# EAGLE design ram (EAGLE 9.6.2)
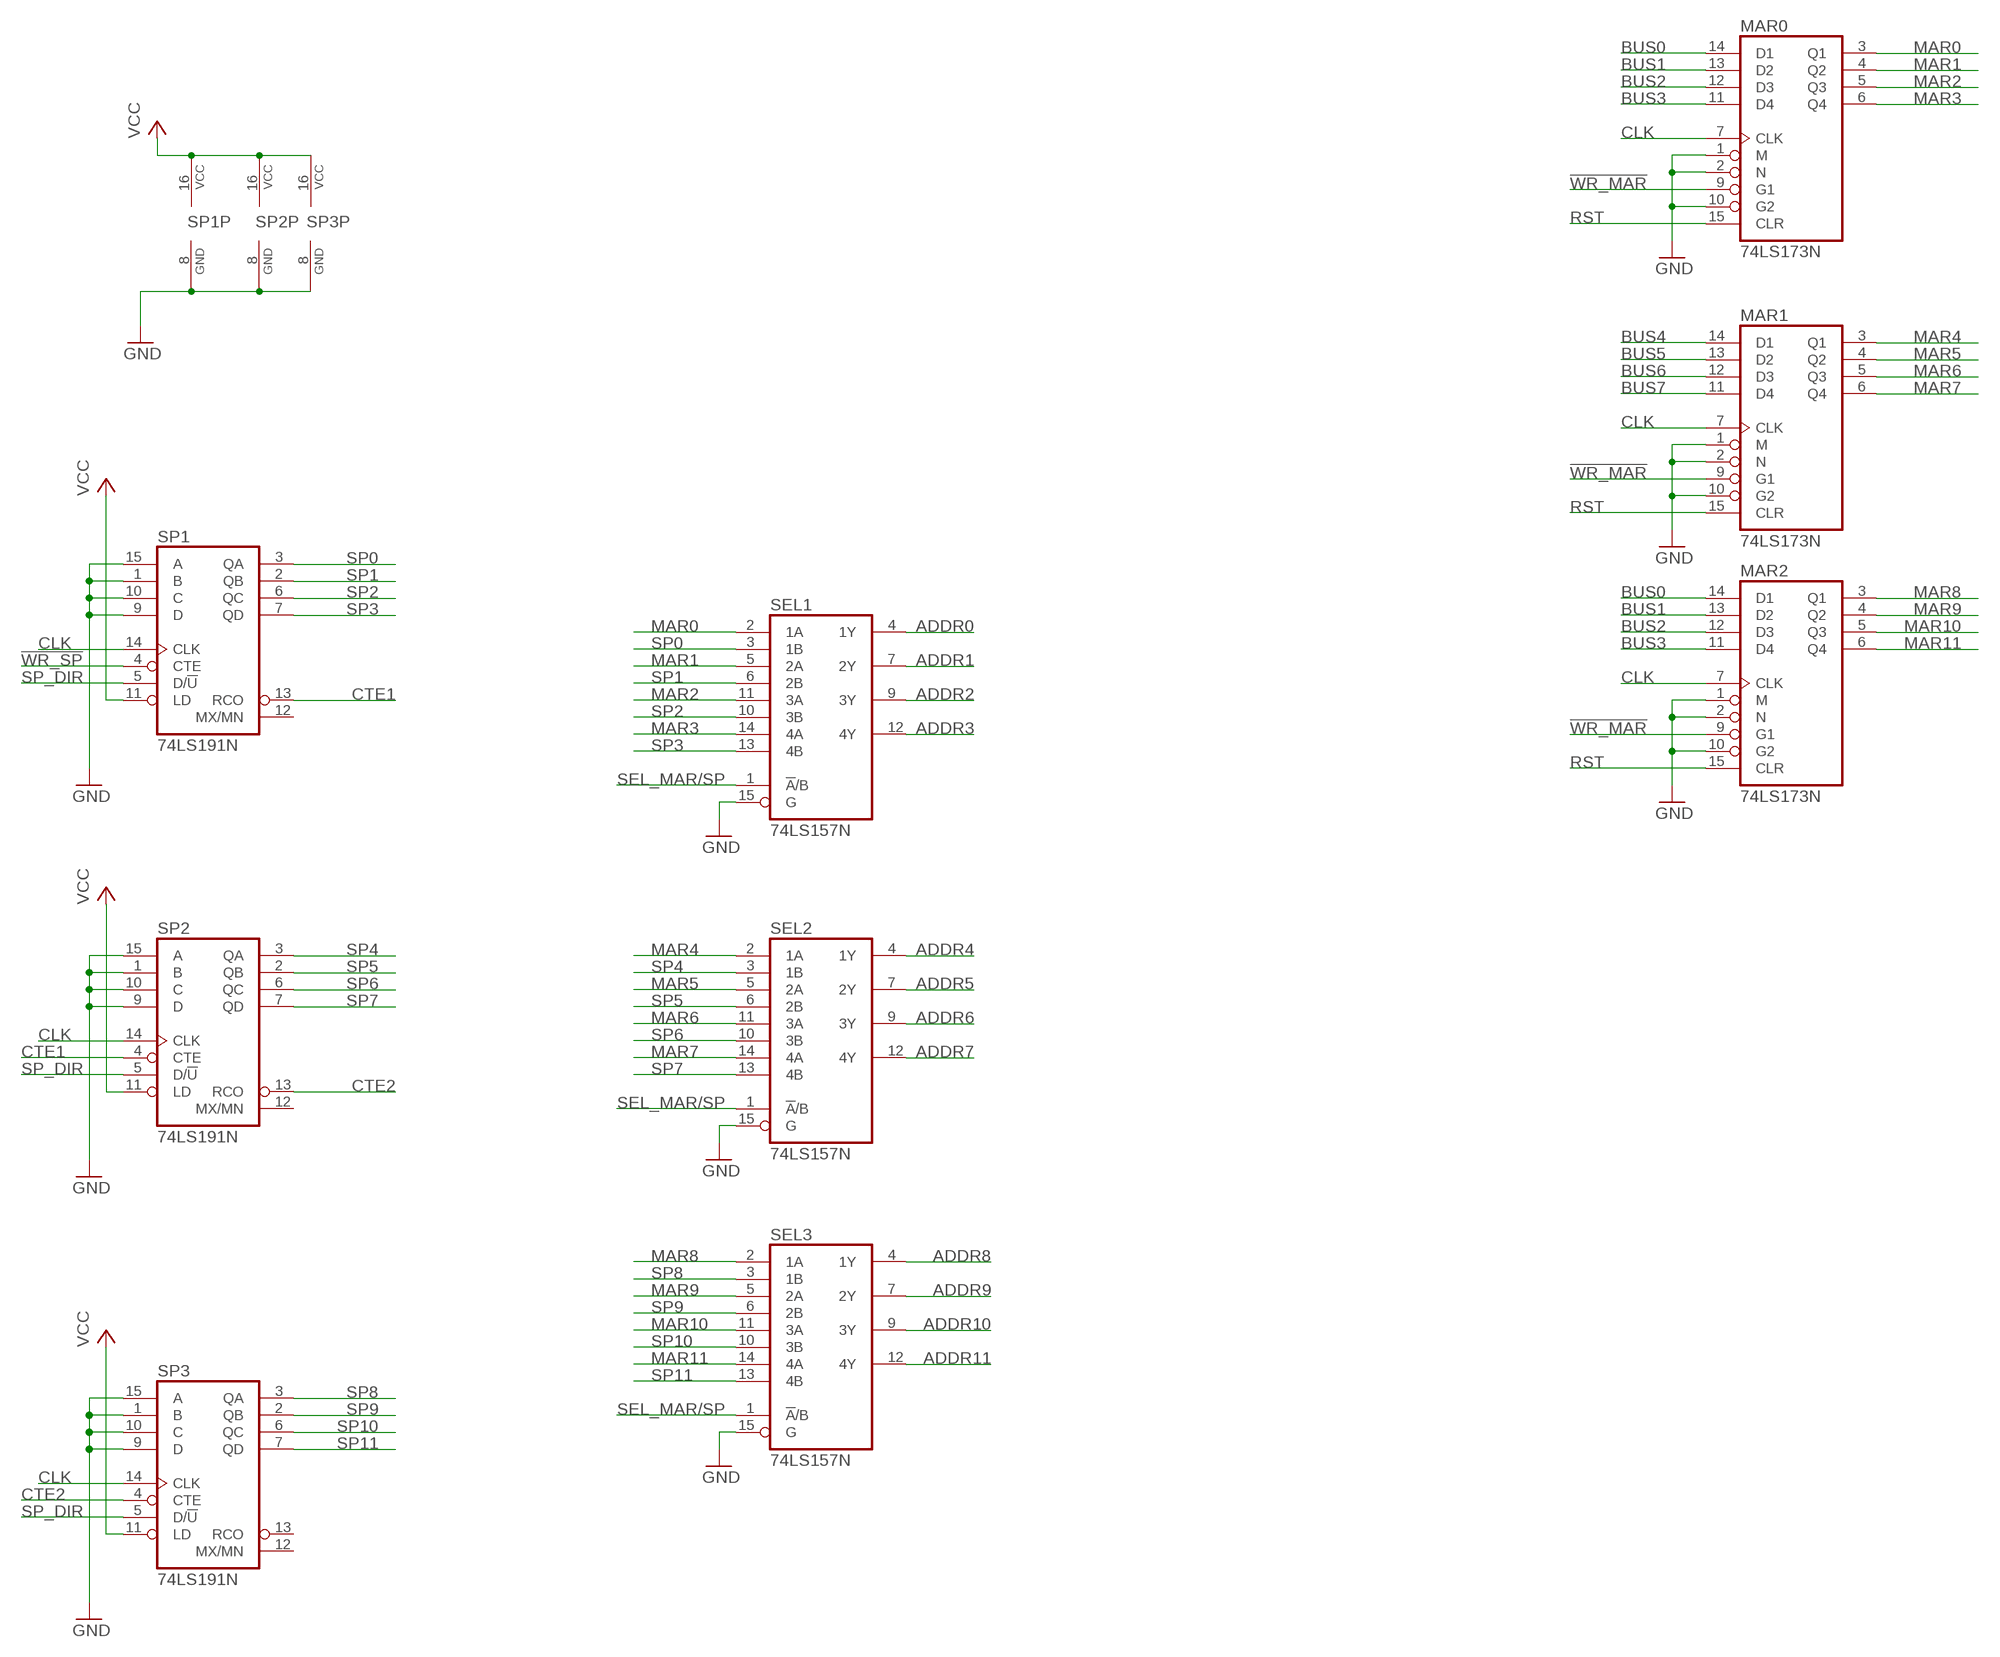
[diagram p0: schematic, sheet 1, part 1 of 2]
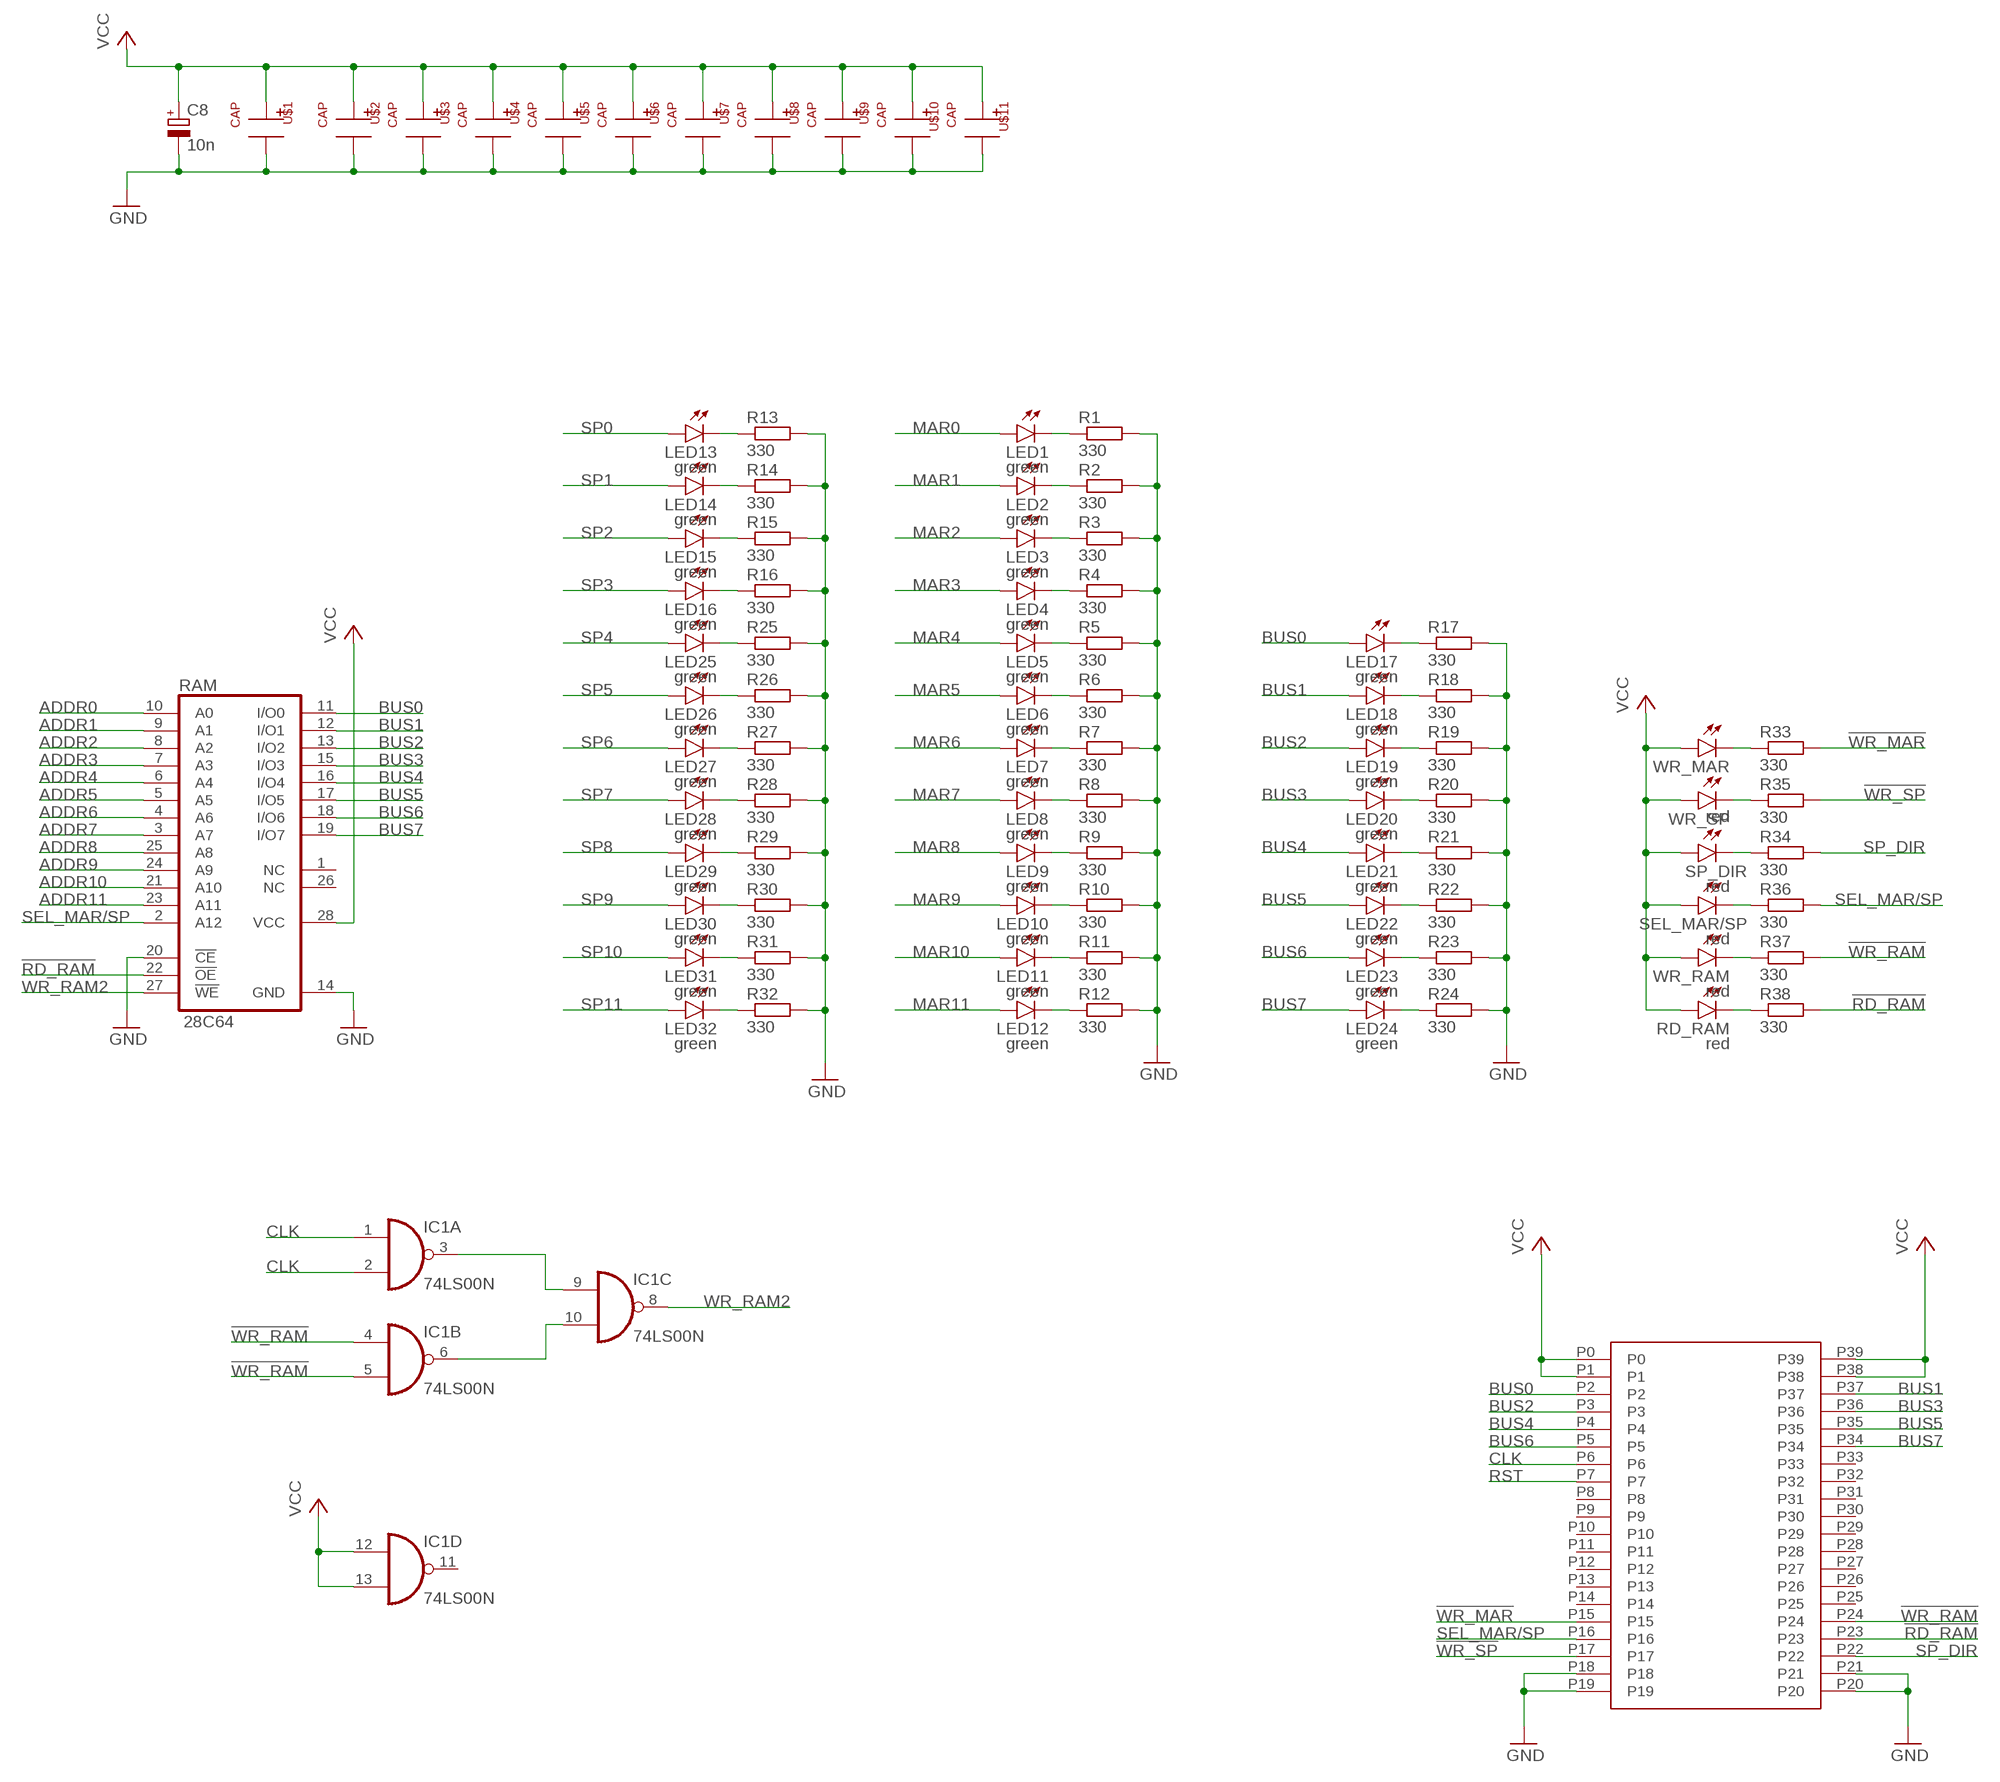
[diagram p1: schematic, sheet 1, part 2 of 2]

## Parts
C8  10n  CPOL-EUE2,5-6E  [E2,5-6E]
IC1  74LS00N  [DIL14]
LED1  green  LEDSML1206  [SML1206]
LED2  green  LEDSML1206  [SML1206]
LED3  green  LEDSML1206  [SML1206]
LED4  green  LEDSML1206  [SML1206]
LED5  green  LEDSML1206  [SML1206]
LED6  green  LEDSML1206  [SML1206]
LED7  green  LEDSML1206  [SML1206]
LED8  green  LEDSML1206  [SML1206]
LED9  green  LEDSML1206  [SML1206]
LED10  green  LEDSML1206  [SML1206]
LED11  green  LEDSML1206  [SML1206]
LED12  green  LEDSML1206  [SML1206]
LED13  green  LEDSML1206  [SML1206]
LED14  green  LEDSML1206  [SML1206]
LED15  green  LEDSML1206  [SML1206]
LED16  green  LEDSML1206  [SML1206]
LED17  green  LEDSML1206  [SML1206]
LED18  green  LEDSML1206  [SML1206]
LED19  green  LEDSML1206  [SML1206]
LED20  green  LEDSML1206  [SML1206]
LED21  green  LEDSML1206  [SML1206]
LED22  green  LEDSML1206  [SML1206]
LED23  green  LEDSML1206  [SML1206]
LED24  green  LEDSML1206  [SML1206]
LED25  green  LEDSML1206  [SML1206]
LED26  green  LEDSML1206  [SML1206]
LED27  green  LEDSML1206  [SML1206]
LED28  green  LEDSML1206  [SML1206]
LED29  green  LEDSML1206  [SML1206]
LED30  green  LEDSML1206  [SML1206]
LED31  green  LEDSML1206  [SML1206]
LED32  green  LEDSML1206  [SML1206]
MAR0  74LS173N  [DIL16]
MAR1  74LS173N  [DIL16]
MAR2  74LS173N  [DIL16]
R1  330  R-EU_R0805  [R0805]
R2  330  R-EU_R0805  [R0805]
R3  330  R-EU_R0805  [R0805]
R4  330  R-EU_R0805  [R0805]
R5  330  R-EU_R0805  [R0805]
R6  330  R-EU_R0805  [R0805]
R7  330  R-EU_R0805  [R0805]
R8  330  R-EU_R0805  [R0805]
R9  330  R-EU_R0805  [R0805]
R10  330  R-EU_R0805  [R0805]
R11  330  R-EU_R0805  [R0805]
R12  330  R-EU_R0805  [R0805]
R13  330  R-EU_R0805  [R0805]
R14  330  R-EU_R0805  [R0805]
R15  330  R-EU_R0805  [R0805]
R16  330  R-EU_R0805  [R0805]
R17  330  R-EU_R0805  [R0805]
R18  330  R-EU_R0805  [R0805]
R19  330  R-EU_R0805  [R0805]
R20  330  R-EU_R0805  [R0805]
R21  330  R-EU_R0805  [R0805]
R22  330  R-EU_R0805  [R0805]
R23  330  R-EU_R0805  [R0805]
R24  330  R-EU_R0805  [R0805]
R25  330  R-EU_R0805  [R0805]
R26  330  R-EU_R0805  [R0805]
R27  330  R-EU_R0805  [R0805]
R28  330  R-EU_R0805  [R0805]
R29  330  R-EU_R0805  [R0805]
R30  330  R-EU_R0805  [R0805]
R31  330  R-EU_R0805  [R0805]
R32  330  R-EU_R0805  [R0805]
R33  330  R-EU_R0805  [R0805]
R34  330  R-EU_R0805  [R0805]
R35  330  R-EU_R0805  [R0805]
R36  330  R-EU_R0805  [R0805]
R37  330  R-EU_R0805  [R0805]
R38  330  R-EU_R0805  [R0805]
RAM  28C64  28C64C  [DIL28-6]
RD_RAM  red  LEDSML1206  [SML1206]
SEL1  74LS157N  [DIL16]
SEL2  74LS157N  [DIL16]
SEL3  74LS157N  [DIL16]
SEL_MAR/SP  red  LEDSML1206  [SML1206]
SP1  74LS191N  [DIL16]
SP2  74LS191N  [DIL16]
SP3  74LS191N  [DIL16]
SP_DIR  red  LEDSML1206  [SML1206]
U$1  CAP  [CAP]
U$2  CAP  [CAP]
U$3  CAP  [CAP]
U$4  CAP  [CAP]
U$5  CAP  [CAP]
U$6  CAP  [CAP]
U$7  CAP  [CAP]
U$8  CAP  [CAP]
U$9  CAP  [CAP]
U$10  CAP  [CAP]
U$11  CAP  [CAP]
U$12  2X40  [2X40]
WR_MAR  red  LEDSML1206  [SML1206]
WR_RAM  red  LEDSML1206  [SML1206]
WR_SP  red  LEDSML1206  [SML1206]

## Nets
!RD_RAM: R38.2 RAM.22(!OE) U$12.P23
!WR_MAR: MAR0.9(G1) MAR1.9(G1) MAR2.9(G1) R33.2 U$12.P15
!WR_RAM: IC1.4(B:I0) IC1.5(B:I1) R37.2 U$12.P24
!WR_SP: R35.2 SP1.4(CTE) U$12.P17
ADDR0: RAM.10(A0) SEL1.4(1Y)
ADDR1: RAM.9(A1) SEL1.7(2Y)
ADDR2: RAM.8(A2) SEL1.9(3Y)
ADDR3: RAM.7(A3) SEL1.12(4Y)
ADDR4: RAM.6(A4) SEL2.4(1Y)
ADDR5: RAM.5(A5) SEL2.7(2Y)
ADDR6: RAM.4(A6) SEL2.9(3Y)
ADDR7: RAM.3(A7) SEL2.12(4Y)
ADDR8: RAM.25(A8) SEL3.4(1Y)
ADDR9: RAM.24(A9) SEL3.7(2Y)
ADDR10: RAM.21(A10) SEL3.9(3Y)
ADDR11: RAM.23(A11) SEL3.12(4Y)
BUS0: LED17.A MAR0.14(D1) MAR2.14(D1) RAM.11(I/O0) U$12.P2
BUS1: LED18.A MAR0.13(D2) MAR2.13(D2) RAM.12(I/O1) U$12.P37
BUS2: LED19.A MAR0.12(D3) MAR2.12(D3) RAM.13(I/O2) U$12.P3
BUS3: LED20.A MAR0.11(D4) MAR2.11(D4) RAM.15(I/O3) U$12.P36
BUS4: LED21.A MAR1.14(D1) RAM.16(I/O4) U$12.P4
BUS5: LED22.A MAR1.13(D2) RAM.17(I/O5) U$12.P35
BUS6: LED23.A MAR1.12(D3) RAM.18(I/O6) U$12.P5
BUS7: LED24.A MAR1.11(D4) RAM.19(I/O7) U$12.P34
CLK: IC1.1(A:I0) IC1.2(A:I1) MAR0.7(CLK) MAR1.7(CLK) MAR2.7(CLK) SP1.14(CLK) SP2.14(CLK) SP3.14(CLK) U$12.P6
CTE1: SP1.13(RCO) SP2.4(CTE)
CTE2: SP2.13(RCO) SP3.4(CTE)
GND [supply]: C8.- MAR0.1(M) MAR0.2(N) MAR0.10(G2) MAR1.1(M) MAR1.2(N) MAR1.10(G2) MAR2.1(M) MAR2.2(N) MAR2.10(G2) R1.2 R2.2 R3.2 R4.2 R5.2 R6.2 R7.2 R8.2 R9.2 R10.2 R11.2 R12.2 R13.2 R14.2 R15.2 R16.2 R17.2 R18.2 R19.2 R20.2 R21.2 R22.2 R23.2 R24.2 R25.2 R26.2 R27.2 R28.2 R29.2 R30.2 R31.2 R32.2 RAM.14(GND) RAM.20(!CE) SEL1.15(G) SEL2.15(G) SEL3.15(G) SP1.1(B) SP1.8(GND) SP1.9(D) SP1.10(C) SP1.15(A) SP2.1(B) SP2.8(GND) SP2.9(D) SP2.10(C) SP2.15(A) SP3.1(B) SP3.8(GND) SP3.9(D) SP3.10(C) SP3.15(A) U$1.P- U$2.P- U$3.P- U$4.P- U$5.P- U$6.P- U$7.P- U$8.P- U$9.P- U$10.P- U$11.P- U$12.P18 U$12.P19 U$12.P20 U$12.P21
MAR0: LED1.A MAR0.3(Q1) SEL1.2(1A)
MAR1: LED2.A MAR0.4(Q2) SEL1.5(2A)
MAR2: LED3.A MAR0.5(Q3) SEL1.11(3A)
MAR3: LED4.A MAR0.6(Q4) SEL1.14(4A)
MAR4: LED5.A MAR1.3(Q1) SEL2.2(1A)
MAR5: LED6.A MAR1.4(Q2) SEL2.5(2A)
MAR6: LED7.A MAR1.5(Q3) SEL2.11(3A)
MAR7: LED8.A MAR1.6(Q4) SEL2.14(4A)
MAR8: LED9.A MAR2.3(Q1) SEL3.2(1A)
MAR9: LED10.A MAR2.4(Q2) SEL3.5(2A)
MAR10: LED11.A MAR2.5(Q3) SEL3.11(3A)
MAR11: LED12.A MAR2.6(Q4) SEL3.14(4A)
N$1: LED1.C R1.1
N$2: LED2.C R2.1
N$3: LED3.C R3.1
N$4: LED4.C R4.1
N$5: LED5.C R5.1
N$6: LED6.C R6.1
N$7: LED7.C R7.1
N$8: LED8.C R8.1
N$9: LED13.C R13.1
N$10: LED9.C R9.1
N$11: LED10.C R10.1
N$12: LED11.C R11.1
N$13: LED12.C R12.1
N$14: LED14.C R14.1
N$15: LED15.C R15.1
N$16: LED16.C R16.1
N$17: LED25.C R25.1
N$18: LED26.C R26.1
N$19: LED17.C R17.1
N$20: LED18.C R18.1
N$21: LED19.C R19.1
N$22: LED20.C R20.1
N$23: LED21.C R21.1
N$24: LED22.C R22.1
N$25: LED23.C R23.1
N$26: LED24.C R24.1
N$27: LED27.C R27.1
N$28: LED28.C R28.1
N$29: LED29.C R29.1
N$30: LED30.C R30.1
N$31: LED31.C R31.1
N$32: LED32.C R32.1
N$33: IC1.3(A:O) IC1.9(C:I0)
N$34: IC1.6(B:O) IC1.10(C:I1)
N$35: R36.1 SEL_MAR/SP.C
N$37: R33.1 WR_MAR.C
N$38: R34.1 SP_DIR.C
N$39: R35.1 WR_SP.C
N$41: R37.1 WR_RAM.C
N$42: R38.1 RD_RAM.C
RST: MAR0.15(CLR) MAR1.15(CLR) MAR2.15(CLR) U$12.P7
SEL_MAR/SP: R36.2 RAM.2(A12) SEL1.1(!A!/B) SEL2.1(!A!/B) SEL3.1(!A!/B) U$12.P16
SP0: LED13.A SEL1.3(1B) SP1.3(QA)
SP1: LED14.A SEL1.6(2B) SP1.2(QB)
SP2: LED15.A SEL1.10(3B) SP1.6(QC)
SP3: LED16.A SEL1.13(4B) SP1.7(QD)
SP4: LED25.A SEL2.3(1B) SP2.3(QA)
SP5: LED26.A SEL2.6(2B) SP2.2(QB)
SP6: LED27.A SEL2.10(3B) SP2.6(QC)
SP7: LED28.A SEL2.13(4B) SP2.7(QD)
SP8: LED29.A SEL3.3(1B) SP3.3(QA)
SP9: LED30.A SEL3.6(2B) SP3.2(QB)
SP10: LED31.A SEL3.10(3B) SP3.6(QC)
SP11: LED32.A SEL3.13(4B) SP3.7(QD)
SP_DIR: R34.2 SP1.5(D/!U) SP2.5(D/!U) SP3.5(D/!U) U$12.P22
VCC [supply]: C8.+ IC1.12(D:I0) IC1.13(D:I1) RAM.28(VCC) RD_RAM.A SEL_MAR/SP.A SP1.11(LD) SP1.16(VCC) SP2.11(LD) SP2.16(VCC) SP3.11(LD) SP3.16(VCC) SP_DIR.A U$1.P+ U$2.P+ U$3.P+ U$4.P+ U$5.P+ U$6.P+ U$7.P+ U$8.P+ U$9.P+ U$10.P+ U$11.P+ U$12.P0 U$12.P1 U$12.P38 U$12.P39 WR_MAR.A WR_RAM.A WR_SP.A
WR_RAM2: IC1.8(C:O) RAM.27(!WE)
Unconnected: IC1.11(D:O) RAM.1(NC) RAM.26(NC) SP1.12(MX/MN) SP2.12(MX/MN) SP3.12(MX/MN) SP3.13(RCO) U$12.P8 U$12.P9 U$12.P10 U$12.P11 U$12.P12 U$12.P13 U$12.P14 U$12.P25 U$12.P26 U$12.P27 U$12.P28 U$12.P29 U$12.P30 U$12.P31 U$12.P32 U$12.P33

## Power pins joined to a net without a drawn wire
GND: IC1.7(P:GND) MAR0.8(GND) MAR1.8(GND) MAR2.8(GND) SEL1.8(GND) SEL2.8(GND) SEL3.8(GND)
VCC: IC1.14(P:VCC) MAR0.16(VCC) MAR1.16(VCC) MAR2.16(VCC) SEL1.16(VCC) SEL2.16(VCC) SEL3.16(VCC)

## Library data of the parts
C8 = rcl:CPOL-EU: POLARIZED CAPACITOR, European symbol; SPICEPREFIX: C
IC1 = 74xx-eu:74*00: Quad 2-input NAND gate
LED1-LED32 RD_RAM SEL_MAR/SP SP_DIR WR_MAR WR_RAM WR_SP = led:LED: LED OSRAM: - CHIPLED LG R971, LG N971, LY N971, LG Q971, LY Q971, LO R971, LY R971 LH N974, LH R974 LS Q976, LO Q976, LY Q976 LO Q996 - Hyper CHIPLED LW Q18S LB Q993, LB Q99A, LB R99A - SideLED LS A670, LO A670, LY A670, LG A670, LP A670 LB A673, LV A673, LT A673, LW A673 LH A674 LY A675 LS A676, LA A676, LO A676, LY A676, LW A676 LS A679, LY A679, LG A679 - Hyper Micro SIDELED® LS Y876, LA Y876, LO Y876, LY Y876 LT Y87S - SmartLED LW L88C, LW L88S LB L89C, LB L89S, LG L890 LS L89K, LO L89K, LY L89K LS L896, LA L896, LO L896, LY L896 - TOPLED LS T670, LO T670, LY T670, LG T670, LP T670 LSG T670, LSP T670, LSY T670, LOP T670, LYG T670 LG T671, LOG T671, LSG T671 LB T673, LV T673, LT T673, LW T673 LH T674 LS T676, LA T676, LO T676, LY T676, LB T676, LH T676, LSB T676, LW T676 LB T67C, LV T67C, LT T67C, LS T67K, LO T67K, LY T67K, LW E67C LS E67B, LA E67B, LO E67B, LY E67B, LB E67C, LV E67C, LT E67C LW T67C LS T679, LY T679, LG T679 LS T770, LO T770, LY T770, LG T770, LP T770 LB T773, LV T773, LT T773, LW T773 LH T774 LS E675, LA E675, LY E675, LS T675 LS T776, LA T776, LO T776, LY T776, LB T776 LHGB T686 LT T68C, LB T68C - Hyper Mini TOPLED® LB M676 - Mini TOPLED Santana® LG M470 LS M47K, LO M47K, LY M47K Source: http://www.osram.convergy.de LUXEON: - LUMILED® LXK2-PW12-R00, LXK2-PW12-S00, LXK2-PW14-U00, LXK2-PW14-V00 LXK2-PM12-R00, LXK2-PM12-S00, LXK2-PM14-U00 LXK2-PE12-Q00, LXK2-PE12-R00, LXK2-PE12-S00, LXK2-PE14-T00, LXK2-PE14-U00 LXK2-PB12-K00, LXK2-PB12-L00, LXK2-PB12-M00, LXK2-PB14-N00, LXK2-PB14-P00, LXK2-PB14-Q00 LXK2-PR12-L00, LXK2-PR12-M00, LXK2-PR14-Q00, LXK2-PR14-R00 LXK2-PD12-Q00, LXK2-PD12-R00, LXK2-PD12-S00 LXK2-PH12-R00, LXK2-PH12-S00 LXK2-PL12-P00, LXK2-PL12-Q00, LXK2-PL12-R00 Source: www.luxeon.com KINGBRIGHT: KA-3528ASYC Source: www.kingbright.com
MAR0 MAR1 MAR2 = 74xx-eu:74*173: 4-bit D type REGISTER, 3-state
R1-R38 = rcl:R-EU_: RESISTOR, European symbol; SPICEPREFIX: R
RAM = memory-nec:28C64C: MEMORY; MPN: AT28C64B-15PU; OC_FARNELL: 1095784; OC_NEWARK: 96K6557
SEL1-SEL3 = 74xx-eu:74*157: Quadruple 2-line to 1-line data SELECTOR/MULTIPLEXER
SP1-SP3 = 74xx-eu:74*191: Synchronous UP/DOWN COUNTER
U$1-U$11 = IsaacAlonso:CAP
U$12 = IsaacAlonso:2X40

## Net classes
1 supply: width 0.508 mm

## Board
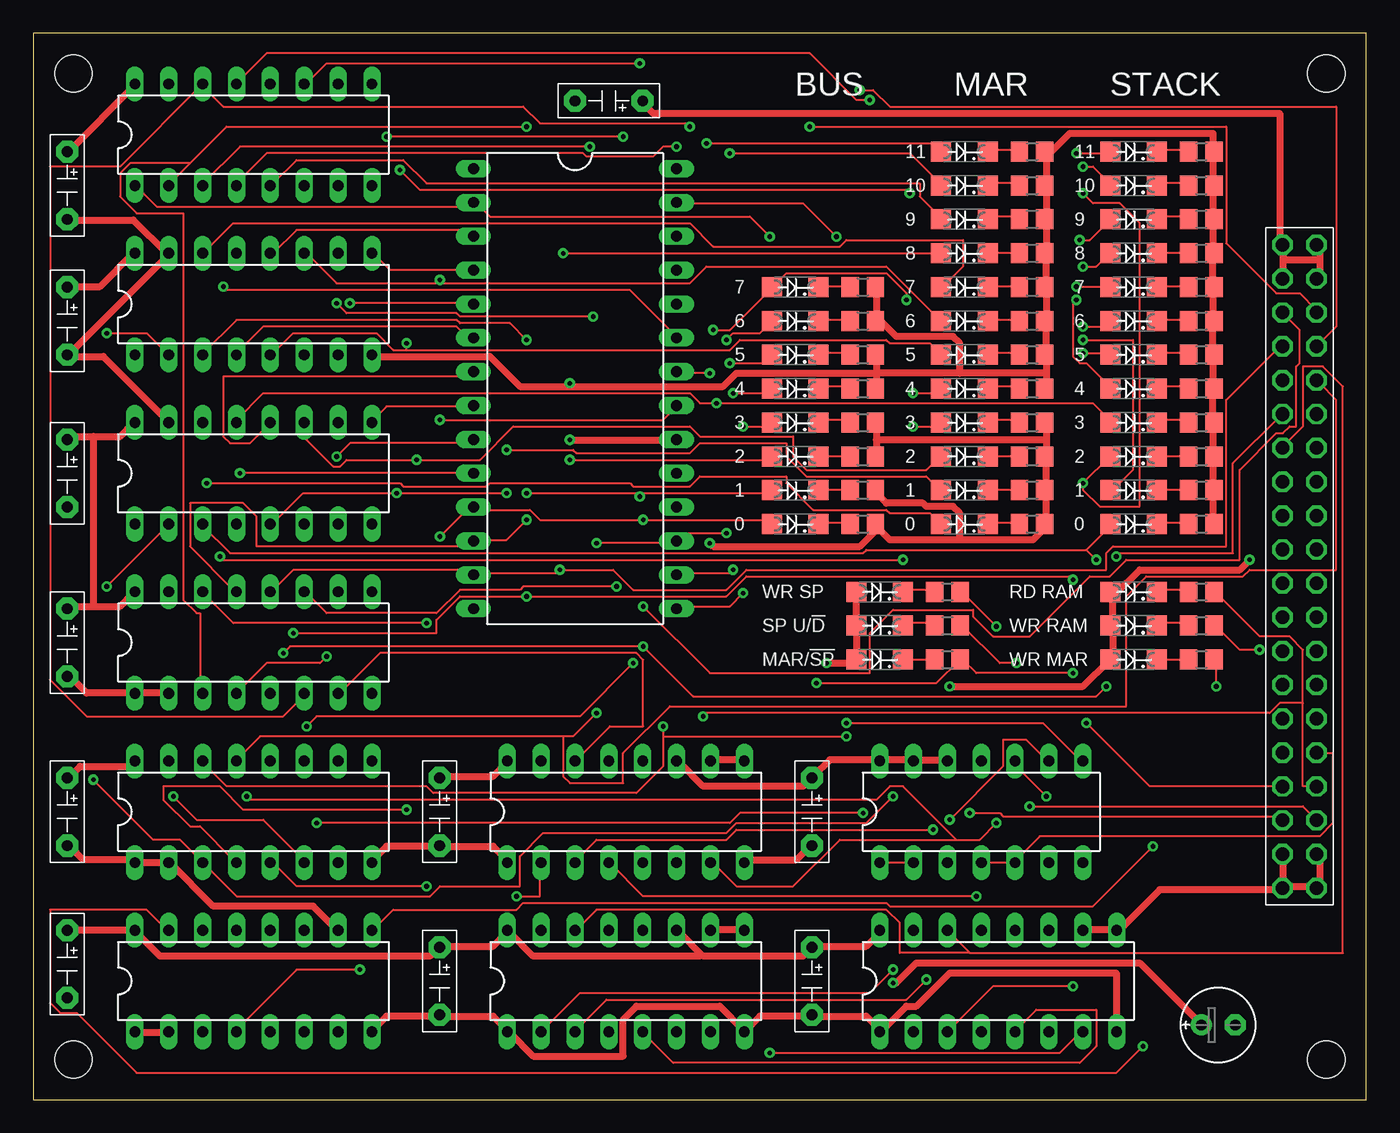
[diagram p2: board, top side]
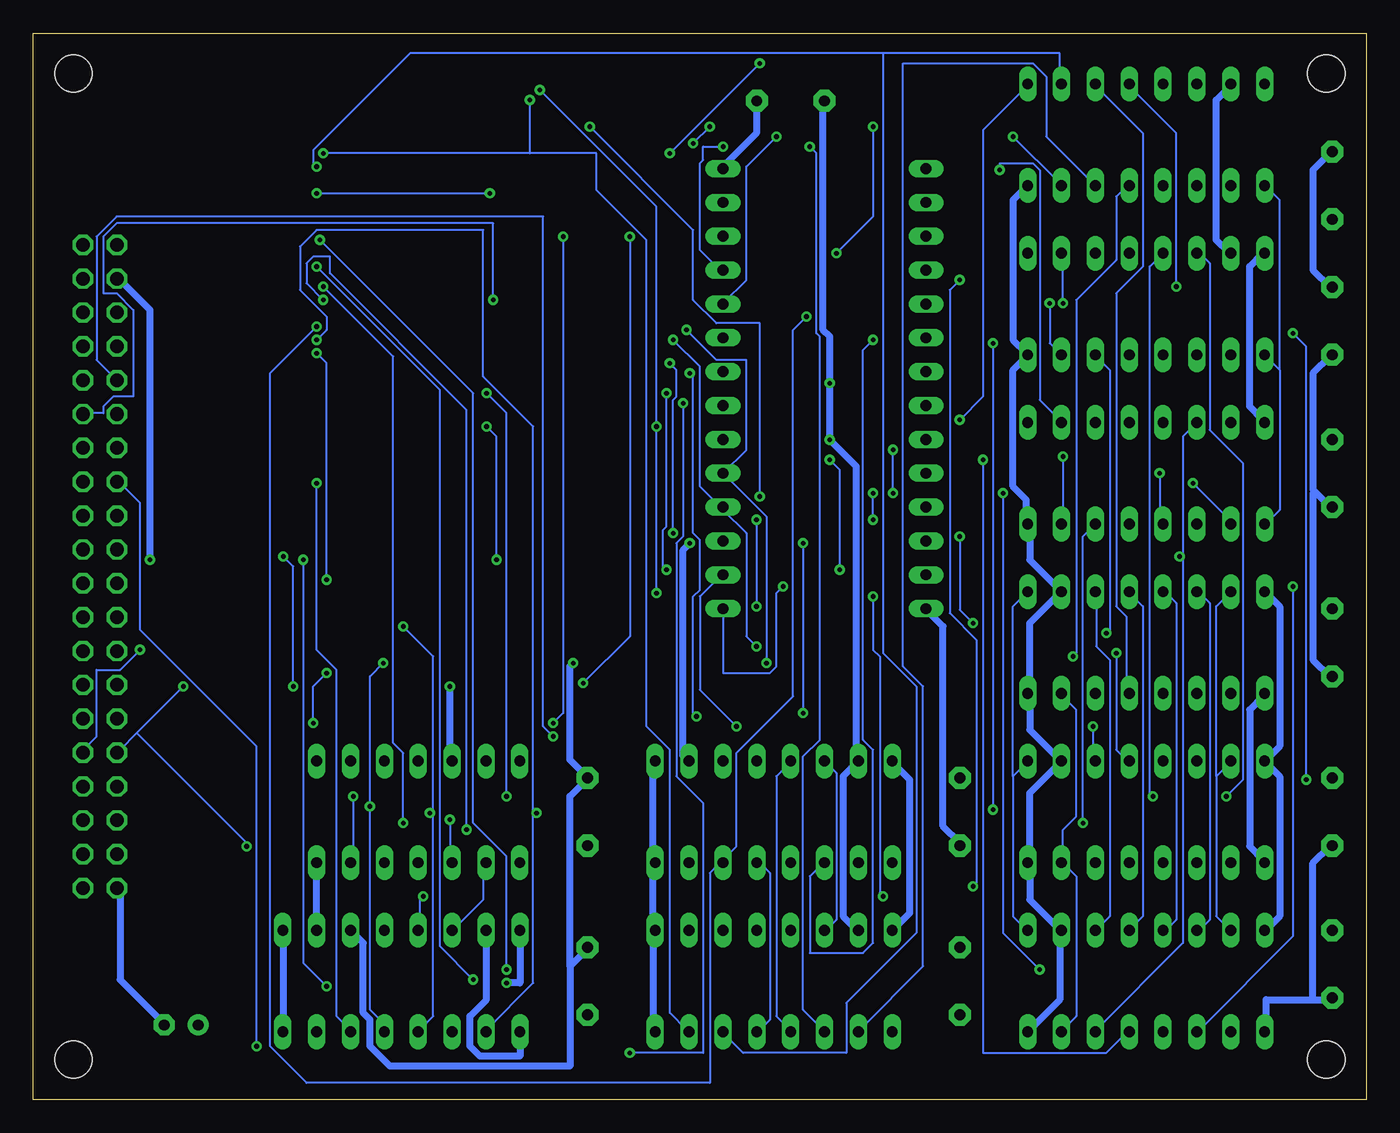
[diagram p3: board, bottom side, seen from below]

Size 100 x 80 mm. Coordinates in mm from the lower left corner, seen from the top.
Outline: 0,0 100,0 100,80 0,80 0,0
Copper layers (1*16): Top 0.035mm / dielectric 1.5mm / Bottom 0.035mm
Design rules "default": minimum track width 6mil, minimum drill 0.35mm, track to track 6mil, track to pad 6mil, pad to pad 6mil, via to via 6mil, smd to smd 6mil, copper to edge 40mil, drill to drill 6mil, minimum pad ring 10mil, minimum via ring 8mil, stop-mask expansion 4mil, vias tented up to drill 0mil, thermal gap 10mil
Holes 2.8 mm at 3,77 97,77 3,3 97,3
vRestrict: area 31,35.6 to 35.1,71.1; area 46.2,35.6 to 50.3,71.1; area 6.1,74.2 to 26.9,78.2; area 6.1,66.5 to 26.9,70.6; area 6.1,61.5 to 26.9,65.5; area 6.1,53.8 to 26.9,57.9; area 6.1,48.8 to 26.9,52.8; area 6.1,41.1 to 26.9,45.2; area 6.1,36.1 to 26.9,40.1; area 6.1,28.4 to 26.9,32.5; area 6.1,23.4 to 26.9,27.4; area 6.1,15.7 to 26.9,19.8; 16 more areas

### Footprints (pad centres in the part's own frame; a part is rotated, then mirrored left to right if it is on the bottom)
E2,5-6E = drill 0.813 pad 1.575: + -1.27,0 | drill 0.813 pad 1.575 octagon: - 1.27,0
DIL14 = drill 0.813 long: 1 -7.62,-3.81; 2 -5.08,-3.81; 3 -2.54,-3.81; 4 0,-3.81; 5 2.54,-3.81; 6 5.08,-3.81; 7 7.62,-3.81; 8 7.62,3.81; 9 5.08,3.81; 10 2.54,3.81; 11 0,3.81; 12 -2.54,3.81; 13 -5.08,3.81; 14 -7.62,3.81
SML1206 = smd 1.5 x 1.5: A 1.75,0; C -1.75,0
DIL16 = drill 0.813 long: 1 -8.89,-3.81; 2 -6.35,-3.81; 3 -3.81,-3.81; 4 -1.27,-3.81; 5 1.27,-3.81; 6 3.81,-3.81; 7 6.35,-3.81; 8 8.89,-3.81; 9 8.89,3.81; 10 6.35,3.81; 11 3.81,3.81; 12 1.27,3.81; 13 -1.27,3.81; 14 -3.81,3.81; 15 -6.35,3.81; 16 -8.89,3.81
R0805 = smd 1.3 x 1.5: 1 -0.95,0; 2 0.95,0
DIL28-6 = drill 0.813 long: 1 -16.51,-7.62; 2 -13.97,-7.62; 3 -11.43,-7.62; 4 -8.89,-7.62; 5 -6.35,-7.62; 6 -3.81,-7.62; 7 -1.27,-7.62; 8 1.27,-7.62; 9 3.81,-7.62; 10 6.35,-7.62; 11 8.89,-7.62; 12 11.43,-7.62; 13 13.97,-7.62; 14 16.51,-7.62; 15 16.51,7.62; 16 13.97,7.62; 17 11.43,7.62; 18 8.89,7.62; 19 6.35,7.62; 20 3.81,7.62; 21 1.27,7.62; 22 -1.27,7.62; 23 -3.81,7.62; 24 -6.35,7.62; 25 -8.89,7.62; 26 -11.43,7.62; 27 -13.97,7.62; 28 -16.51,7.62
CAP = drill 0.813 pad 1.651 octagon: P+ 0,2.54; P- 0,-2.54
2X40 = drill 1.016 octagon: P0 -1.27,24.13; P1 -1.27,21.59; P2 -1.27,19.05; P3 -1.27,16.51; P4 -1.27,13.97; P5 -1.27,11.43; P6 -1.27,8.89; P7 -1.27,6.35; P8 -1.27,3.81; P9 -1.27,1.27; P10 -1.27,-1.27; P11 -1.27,-3.81; P12 -1.27,-6.35; P13 -1.27,-8.89; P14 -1.27,-11.43; P15 -1.27,-13.97; P16 -1.27,-16.51; P17 -1.27,-19.05; P18 -1.27,-21.59; P19 -1.27,-24.13; P20 1.27,-24.13; P21 1.27,-21.59; P22 1.27,-19.05; P23 1.27,-16.51; P24 1.27,-13.97; P25 1.27,-11.43; P26 1.27,-8.89; P27 1.27,-6.35; P28 1.27,-3.81; P29 1.27,-1.27; P30 1.27,1.27; P31 1.27,3.81; P32 1.27,6.35; P33 1.27,8.89; P34 1.27,11.43; P35 1.27,13.97; P36 1.27,16.51; P37 1.27,19.05; P38 1.27,21.59; P39 1.27,24.13

### Placement (x,y rotation side)
C8  88.9,5.59 0 top
IC1  71.12,21.59 0 top
LED1  69.85,43.18 180 top
LED2  69.85,45.72 180 top
LED3  69.85,48.26 180 top
LED4  69.85,50.8 180 top
LED5  69.85,53.34 180 top
LED6  69.85,55.88 180 top
LED7  69.85,58.42 180 top
LED8  69.85,60.96 180 top
LED9  69.85,63.5 180 top
LED10  69.85,66.04 180 top
LED11  69.85,68.58 180 top
LED12  69.85,71.12 180 top
LED13  82.55,43.18 180 top
LED14  82.55,45.72 180 top
LED15  82.55,48.26 180 top
LED16  82.55,50.8 180 top
LED17  57.15,43.18 180 top
LED18  57.15,45.72 180 top
LED19  57.15,48.26 180 top
LED20  57.15,50.8 180 top
LED21  57.15,53.34 180 top
LED22  57.15,55.88 180 top
LED23  57.15,58.42 180 top
LED24  57.15,60.96 180 top
LED25  82.55,53.34 180 top
LED26  82.55,55.88 180 top
LED27  82.55,58.42 180 top
LED28  82.55,60.96 180 top
LED29  82.55,63.5 180 top
LED30  82.55,66.04 180 top
LED31  82.55,68.58 180 top
LED32  82.55,71.12 180 top
MAR0  16.51,8.89 0 top
MAR1  16.51,21.59 0 top
MAR2  16.51,34.29 0 top
R1  74.93,43.18 0 top
R2  74.93,45.72 0 top
R3  74.93,48.26 0 top
R4  74.93,50.8 0 top
R5  74.93,53.34 0 top
R6  74.93,55.88 0 top
R7  74.93,58.42 0 top
R8  74.93,60.96 0 top
R9  74.93,63.5 0 top
R10  74.93,66.04 0 top
R11  74.93,68.58 0 top
R12  74.93,71.12 0 top
R13  87.63,43.18 0 top
R14  87.63,45.72 0 top
R15  87.63,48.26 0 top
R16  87.63,50.8 0 top
R17  62.23,43.18 0 top
R18  62.23,45.72 0 top
R19  62.23,48.26 0 top
R20  62.23,50.8 0 top
R21  62.23,53.34 0 top
R22  62.23,55.88 0 top
R23  62.23,58.42 0 top
R24  62.23,60.96 0 top
R25  87.63,53.34 0 top
R26  87.63,55.88 0 top
R27  87.63,58.42 0 top
R28  87.63,60.96 0 top
R29  87.63,63.5 0 top
R30  87.63,66.04 0 top
R31  87.63,68.58 0 top
R32  87.63,71.12 0 top
R33  87.63,33.02 0 top
R34  68.58,35.56 0 top
R35  68.58,38.1 0 top
R36  68.58,33.02 0 top
R37  87.63,35.56 0 top
R38  87.63,38.1 0 top
RAM  40.64,53.34 270 top
RD_RAM  82.55,38.1 180 top
SEL1  16.51,46.99 0 top
SEL2  16.51,59.69 0 top
SEL3  16.51,72.39 0 top
SEL_MAR/SP  63.5,33.02 180 top
SP1  72.39,8.89 0 top
SP2  44.45,21.59 0 top
SP3  44.45,8.89 0 top
SP_DIR  63.5,35.56 180 top
U$1  2.54,10.16 0 top
U$2  2.54,21.59 0 top
U$3  2.54,34.29 0 top
U$4  2.54,46.99 0 top
U$5  2.54,58.42 0 top
U$6  2.54,68.58 0 top
U$7  30.48,21.59 0 top
U$8  30.48,8.89 0 top
U$9  58.42,21.59 0 top
U$10  58.42,8.89 0 top
U$11  43.18,74.93 270 top
U$12  95,40 0 top
WR_MAR  82.55,33.02 180 top
WR_RAM  82.55,35.56 180 top
WR_SP  63.5,38.1 180 top

### Tracks (layer width: path | path; a pad name or v marks a point on that pad's centre or on a via)
!RD_RAM  (via drill 0.35)
  Top 0.152: 95.25,29.75 95.25,23.5 96.25,23.5 U$12.P23 | 95.25,29.75 95.25,33.75 94.25,34.75 92,34.75 88.75,38 R38.2 | v50.75,54.5 48.5,54.5 RAM.22 | v50.25,28.75 50.5,29 92.75,29 93.5,29.75 95.25,29.75
  Bottom 0.152: v50.75,54.5 50.5,54.25 50.5,42.5 50,42 50,38.25 50.5,37.75 50.5,29 v50.25,28.75
!WR_MAR  (via drill 0.35)
  Top 0.152: v88.75,31 88.75,33 R33.2 | v84,19 79.5,14.5 64.25,14.5 64,14.75 36.75,14.75 36.25,14.25 27,14.25 25.5,12.75 MAR0.9
  Bottom 0.152: 92.25,27.5 93.5,26.25 U$12.P15 | 92.25,27.5 v88.75,31 | 26.5,24.25 26.5,13.75 25.5,12.75 MAR0.9 | 26.5,24.25 25.5,25.25 MAR1.9 | MAR2.9 26.5,37 26.5,24.25 | 92.25,27.5 84,19.25 v84,19
!WR_RAM  (via drill 0.35)
  Top 0.152: IC1.4 71.25,17.75 73.5,17.75 IC1.5 73.75,18 75.5,19.75 96.5,19.75 97.5,20.75 97.5,26 96.5,26 U$12.P24 | v92,33.75 90.5,33.75 88.75,35.5 R37.2
  Bottom 0.152: v92,33.75 93.5,32.25 95.25,32.25 95.25,27.25 96.25,26.25 U$12.P24
!WR_SP  (via drill 0.35)
  Top 0.152: v72.25,35.5 69.75,38 R35.2 | v70.25,21.5 72.5,21.5 72.75,21.25 93.25,21.25 93.5,21 U$12.P17
  Bottom 0.152: v72.25,35.5 70,33.25 70,21.5 | 70,21.5 70,6.25 71,5.25 SP1.4 | 70,21.5 v70.25,21.5
ADDR0  (via drill 0.35)
  Top 0.152: v15.5,47 33,47 RAM.10
  Bottom 0.152: v15.5,47 15.5,43.5 15.25,43.25 SEL1.4
ADDR1  (via drill 0.35)
  Top 0.152: v22.75,48.25 23.75,49.25 32.75,49.25 33,49.5 RAM.9
  Bottom 0.152: v22.75,48.25 22.75,43.25 SEL1.7
ADDR2
  Top 0.152: SEL1.9 25.5,51 26.5,52 33,52 RAM.8
ADDR3
  Top 0.152: SEL1.12 17.75,50.75 16.25,49.25 14.75,49.25 14.25,49.75 14.25,54.25 32.75,54.25 33,54.5 RAM.7
ADDR4
  Top 0.152: SEL2.4 15.25,56 17.25,58 31.75,58 32.5,57.25 33,57.25 RAM.6
ADDR5  (via drill 0.35)
  Top 0.152: v23.75,59.75 33,59.75 RAM.5
  Bottom 0.152: v23.75,59.75 23.75,56.75 23,56 SEL2.7
ADDR6
  Top 0.152: SEL2.9 25.5,63.5 26.75,62.25 33,62.25 RAM.4
ADDR7
  Top 0.152: SEL2.12 18,63.5 19.75,65.25 32.75,65.25 33,65 RAM.3
ADDR8  (via drill 0.35)
  Top 0.152: v48.25,71.5 47.25,71.5 46.5,70.75 41.5,70.75 41.25,71 17.5,71 15.25,68.75 SEL3.4
  Bottom 0.152: v48.25,71.5 49.75,71.5 49.75,70.5 50,70.25 50,63.75 48.5,62.25 RAM.25
ADDR9  (via drill 0.35)
  Top 0.152: v44.25,72.25 v26.5,72.25
  Bottom 0.152: v26.5,72.25 23,68.75 SEL3.7 | v44.25,72.25 46.5,70 46.5,61.5 48.25,59.75 RAM.24
ADDR10  (via drill 0.35)
  Top 0.152: v30.5,51 47.25,51 48.25,52 RAM.21
  Bottom 0.152: v30.5,51 28.75,52.75 28.75,72.75 25.5,76 SEL3.9
ADDR11  (via drill 0.35)
  Top 0.152: v14.25,61 14.5,60.75 44.75,60.75 48.25,57.25 RAM.23
  Bottom 0.152: v14.25,61 14.25,72.5 17.75,76 SEL3.12
BUS0  (via drill 0.35)
  Top 0.152: LED17.A 55.25,43.25 55,43.5 v45.75,43.5 38,43.5 37.25,44.25 33.25,44.25 RAM.11 33,44.25 32.5,44.25 v30.5,42.25 | v45.75,37 50.75,32 62.75,32 62.75,35 64.5,36.75 70.5,36.75 70.5,36.25 72,34.75 74.75,34.75 79.25,39.25 80.75,39.25 82,40.5 90.5,40.5 90.5,47.25 93.25,50 93.75,50 94.25,50.5 94.75,50.5 94.75,55 95,55.25 95,57.75 93.75,59 U$12.P2 | v29.5,35.75 15,35.75 12.75,38 MAR2.14
  Bottom 0.152: MAR0.14 12.5,12.75 11.75,13.5 11.75,37.25 12.5,38 MAR2.14 | v45.75,43.5 v45.75,37 | v29.5,35.75 30.5,36.75 v30.5,42.25
BUS1  (via drill 0.35)
  Top 0.152: v37,45.5 45.5,45.5 | 45.5,45.5 55.25,45.5 LED18.A | v37,43.5 35.5,42 33.25,42 RAM.12 33,41.75 32.75,41.5 16.75,41.5 16.75,43.75 15.75,44.75 11.75,44.75 11.75,41.5 15,38.25 MAR2.13 | v58.25,73 89.5,73 89.5,64.25 93.25,60.5 95,60.5 96.25,59.25 U$12.P37 | 45.5,45.5 v45.5,45.25
  Bottom 0.152: MAR0.13 15,12.75 14.25,13.5 14.25,37.25 15,38 MAR2.13 | v37,43.5 v37,45.5 | v58.25,73 50.5,65.25 50.5,60 48.75,58.25 45.5,58.25 v45.5,45.25
BUS2  (via drill 0.35)
  Top 0.152: v40.25,48 55,48 55.25,48.25 LED19.A | U$12.P3 93.5,56.5 89.5,52.5 89.5,41.5 81,41.5 80.5,41 80.5,39.75 53.5,39.75 52,38.25 45,38.25 43.5,39.75 v39.5,39.75 39.25,39.5 33.25,39.5 RAM.13 33,39.5 32.75,39.75 19.5,39.75 18,38.25 MAR2.12
  Bottom 0.152: MAR0.12 17.75,12.75 16.75,13.75 16.75,37 17.75,38 MAR2.12 | v40.25,48 39.5,47.25 v39.5,39.75
BUS3  (via drill 0.35)
  Top 0.152: v53.25,50.5 55,50.5 55.25,50.75 LED20.A | v53.25,38 52.25,37 48.5,37 RAM.15 | v62,75.75 63,75.75 64.25,74.5 97.75,74.5 97.75,58 96.5,56.75 U$12.P36 | v43.75,38.5 36.75,38.5 36.5,38.25 32,38.25 30.25,36.5 22,36.5 20.5,38 MAR2.11
  Bottom 0.152: MAR0.11 20.25,12.75 19.25,13.75 19.25,33 20.25,34 20.25,38 MAR2.11 | v53.25,38 v53.25,50.5 53.25,67 v62,75.75 | v43.75,38.5 44.25,38 44.25,32.5 44.75,32 48.25,32 48.25,36.75 RAM.15
BUS4  (via drill 0.35)
  Top 0.152: v52.5,53 55,53 55.25,53.25 LED21.A | v52.5,39.75 52.25,39.5 48.5,39.5 RAM.16 | v47.25,28 47.25,27.25 | 47.25,27.25 47.25,25 45.25,23 30,23 29.5,23.5 14.5,23.5 12.75,25.25 MAR1.14 | 47.25,27.25 v61,27.25
  Bottom 0.152: v52.5,53 52.5,43 52.75,42.75 52.75,40 v52.5,39.75 | v47.25,28 50,30.75 50,37.75 48.5,39.25 RAM.16 | v61,27.25 61.75,28 61.75,66.25 93.75,66.25 95.25,64.75 95.25,55.5 93.75,54 U$12.P4
BUS5  (via drill 0.35)
  Top 0.152: v52.25,55.25 54.75,55.25 55.25,55.75 LED22.A | v52,42.5 49,42.5 48.5,42 RAM.17 48.25,41.75 v42.25,41.75 | 39.75,27.25 40.5,27.25 v42.25,29 | 39.75,27.25 17,27.25 15.25,25.5 MAR1.13 | 39.75,27.25 39.75,24.25 40.25,23.75 44.25,23.75 44.25,26 47.75,29.5 82,29.5 82,37.75 83.5,39.25 90.75,39.25 91.25,39.75 97.75,39.75 97.75,52.5 96.5,53.75 U$12.P35
  Bottom 0.152: v52.25,55.25 51.75,54.75 51.75,52.75 52,52.5 v52,42.5 | v42.25,41.75 v42.25,29
BUS6  (via drill 0.35)
  Top 0.152: v52,57 52.5,57.5 54.5,57.5 55.25,58.25 LED23.A | v18.75,33.5 19.25,34 v45.75,34 49.5,30.25 79.75,30.25 v80.5,31 | v81.25,40.75 81.5,41 90,41 90,47.75 93.5,51.25 U$12.P5
  Bottom 0.152: v52,57 50,55 50,46 48.5,44.5 RAM.18 48.25,44.25 46.5,42.5 46.5,34.75 v45.75,34 | v18.75,33.5 18.75,26.25 18,25.5 MAR1.12 | v81.25,40.75 80.5,40 v80.5,31
BUS7  (via drill 0.35)
  Top 0.152: v51,57.75 52.25,57.75 55.25,60.75 LED24.A 55.5,61 56.5,62 64,62 65.5,60.5 v65.5,60 | v20.5,28 21.25,28.75 41,28.75 v45,32.75
  Bottom 0.152: v51,57.75 48.75,55.5 46.5,55.5 46.5,48.75 RAM.19 | v20.5,28 20.5,25.5 MAR1.11 | v45,32.75 45,43.75 RAM.19 | RAM.19 | v65.5,60 65.5,65.75 93.75,65.75 94.75,64.75 94.75,60.5 93.75,60.5 92.5,59.25 92.5,52.75 94,52.75 94.75,52 94.75,51.5 96.25,51.5 U$12.P34
CLK
  Top 0.152: IC1.1 63.5,17.75 66,17.75 IC1.2 | 70.25,11 98.25,11 98.25,53.5 96.75,55 95.25,55 95.25,50.5 93.75,49 U$12.P6 | 70.25,11 68.75,12.5 SP1.14 | 70.25,11 65,11 65,13.25 64,14.25 42.25,14.25 40.75,12.75 SP3.14 | MAR2.7 23,30.5 26,33.5 45.25,33.5 45.75,33 45.75,28 43.25,28 40.75,25.5 SP2.14
  Bottom 0.152: MAR0.7 22.75,5.25 21.75,6.25 21.75,16.75 22.75,17.75 MAR1.7 22.75,18 22.75,20.25 21.75,21.25 21.75,29.25 22.75,30.25 MAR2.7 | SP3.14 40.5,12.75 39.75,13.5 39.75,24.5 40.5,25.25 SP2.14 | SP1.14 68.5,12.75 66.25,15 66.25,17.75 IC1.2
CTE1  (via drill 0.35)
  Top 0.152: v70.75,15.25 45.75,15.25 43.25,17.75 SP2.4
  Bottom 0.152: v70.75,15.25 71,15 71,12.75 SP1.13
CTE2
  Bottom 0.152: SP3.4 43.25,5.25 44.25,6.25 44.25,24.25 43.25,25.25 SP2.13
GND  (via drill 0.35)
  Top 0.508: SP1.10 78.75,12.75 81.25,12.75 SP1.9 81.5,12.75 84.5,15.75 93.5,15.75 U$12.P19 | U$12.P21 96.5,18.25 96.5,16 U$12.P20 96.25,16 94,16 U$12.P19 | U$12.P19 93.75,16 93.75,18.25 U$12.P18 | 63.25,49.5 63.25,50.75 R20.2 | 63.25,49.5 63.25,48.5 R19.2 | 76,49.5 76,50.75 R4.2 | 76,49.5 76,48.5 R3.2 76,48.25 76,45.75 R2.2 76,45.5 76,43.25 R1.2 76,43 75,42 69.5,42 | 76,49.5 63.25,49.5 | 69.5,42 64.25,42 63.25,43 R17.2 63.25,42.75 62,41.5 51,41.5 v50.75,41.75 | 69.5,42 69.5,44 69,44.5 67,44.5 66.75,44.75 64,44.75 63.25,45.5 R18.2 | SP2.10 51,25.5 53.25,25.5 SP2.9 | SP3.10 51,12.75 53.25,12.75 SP3.9 | U$9.P- 58.25,19 57.25,18 53.5,18 SP2.8 | SP1.8 81.25,5.25 81.25,9.5 68.75,9.5 66.25,7 65.5,7 63.75,5.25 SP1.1 63.5,5.25 62.5,6.25 58.5,6.25 U$10.P- 58.25,6.25 54.5,6.25 53.5,5.25 SP3.8 53.25,5.25 51.5,7 45.25,7 44.25,6 44.25,3.25 37.5,3.25 35.75,5 SP3.1 35.5,5.25 34.5,6.25 30.5,6.25 U$8.P- 30.25,6.25 26.5,6.25 25.5,5.25 MAR0.8 | U$2.P- 2.75,19 3.75,18 7.5,18 MAR1.1 7.75,17.75 10,17.75 MAR1.2 10.25,17.75 13.5,14.5 21,14.5 22.75,12.75 MAR0.10 | MAR0.1 7.75,5 10,5 MAR0.2 | U$6.P- 2.75,66 7.5,66 10,63.5 SEL2.15 10,63.25 2.75,56 U$5.P- 2.75,55.75 5.25,55.75 10,51 SEL1.15 | MAR2.2 10,30.5 7.75,30.5 MAR2.1 7.5,30.5 4,30.5 2.75,31.75 U$3.P- | v40.25,49.5 48.25,49.5 RAM.20 | R13.2 88.5,43.25 88.5,45.5 R14.2 88.5,45.75 88.5,48.25 R15.2 88.5,48.5 88.5,50.75 R16.2 88.5,51 88.5,53.25 R25.2 88.5,53.5 88.5,55.75 R26.2 88.5,56 88.5,58.25 R27.2 88.5,58.5 88.5,60.75 R28.2 88.5,61 88.5,63.25 R29.2 88.5,63.5 88.5,66 R30.2 88.5,66.25 88.5,68.5 R31.2 88.5,68.75 88.5,71 R32.2 88.5,71.25 88.5,72.5 77.75,72.5 76.25,71 R12.2 76,71 76,68.75 R11.2 76,68.5 76,66.25 R10.2 76,66 76,63.5 R9.2 76,63.25 76,61 R8.2 76,60.75 76,58.5 R7.2 76,58.25 76,56 R6.2 76,55.75 76,54.5
  Top 0.508: R24.2 63.25,60.75 63.25,58.5 R23.2 63.5,58.5 64.75,57.25 69,57.25 69.5,56.75 69.5,54.5 | 63.25,54.5 63.25,55.75 R22.2 | 63.25,54.5 63.25,53.5 R21.2 | 76,54.5 76,53.5 R5.2 | 76,54.5 69.5,54.5 | 69.5,54.5 63.25,54.5 | SP2.1 35.5,18 34.5,19 30.5,19 U$7.P- 30.25,19 26.5,19 25.5,18 MAR1.8 | 63.25,54.5 52.75,54.5 51.75,53.5 40.25,53.5 | 40.25,53.5 36.5,53.5 34.25,55.75 25.5,55.75 SEL2.8 | v40.25,53.75 40.25,53.5
  Bottom 0.508: SP1.8 81.25,5.25 81.25,12.5 SP1.9 | IC1.7 78.75,17.75 78.75,12.75 SP1.10 | C8.- 90.25,5.75 93.5,9 93.5,15.75 U$12.P19 | SP1.1 63.5,3.25 66.5,3.25 67.25,4 67.25,6.25 66,7.5 66,12.5 SP1.15 | SP2.9 53.5,25.25 53.5,18 SP2.8 53.5,17.75 53.5,12.75 SP3.9 53.5,12.5 53.5,5.25 SP3.8 | v50.75,41.75 51.25,41.25 51.25,25.75 51,25.5 SP2.10 | 4,7.5 7.5,7.5 7.5,5.25 MAR0.1 | 4,7.5 2.75,7.5 U$1.P- | 4,7.5 4,17.75 2.75,19 U$2.P- | SEL3.15 10.25,76 11.25,75 11.25,64.5 10.25,63.5 SEL2.15 | 3.88,45.62 4,45.75 4,54.5 2.75,55.75 U$5.P- | 3.88,45.62 2.75,44.5 U$4.P- | U$3.P- 2.75,31.75 4,33 4,45.5 3.88,45.62 | MAR1.1 7.75,18 8.75,19 8.75,29.25 7.75,30.25 MAR2.1 | SP3.15 38.25,12.75 39.25,13.75 39.25,24.25 SP2.15 38.25,25.5 38.25,47.5 v40.25,49.5 v40.25,53.75 40.25,57.25 40.75,57.75 40.75,74.75 U$11.P- | SEL3.8 25.5,68.5 26.5,67.5 26.5,57 25.5,56 SEL2.8 25.5,55.75 26.5,54.75 26.5,46 25.5,45 25.5,43.25 SEL1.8 25.25,43 25.25,40.5 23,38.25 MAR2.10 23,38 25.25,35.75 25.25,30.5 MAR2.8 25.25,30.25 25.25,27.75 23,25.5 MAR1.10 23,25.25 25.25,23 25.25,18 MAR1.8 25.25,17.75 25.25,15 23,12.75 MAR0.10 23,12.5 23,7.5 25.25,5.25 MAR0.8 | RAM.14 33,36.75 31.75,35.5 31.75,20.5 30.5,19.25 U$7.P-
MAR0  (via drill 0.35)
  Top 0.152: v13,46.25 27.5,46.25 27.75,46 34,46 34.25,46.25 44.75,46.25 45,46 49.25,46 50,46.75 56.5,46.75 56.5,46.25 58.5,44.25 64,44.25 64.25,44 67.25,44 68,43.25 LED1.A | v5.5,38.5 10,43 SEL1.2
  Bottom 0.152: v13,46.25 10.25,43.5 10.25,43.25 SEL1.2 | v5.5,38.5 5.5,12.25 12.5,5.25 MAR0.3
MAR1  (via drill 0.35)
  Top 0.152: v35.5,48.75 40.5,48.75 40.75,48.5 49.25,48.5 50,49.25 56.5,49.25 56.5,48.25 58,46.75 67,46.75 68,45.75 LED2.A | v35.5,45.5 v27.25,45.5 20.25,45.5 18,43.25 SEL1.5 | v24.5,9.75 19.75,9.75 15.25,5.25 MAR0.4
  Bottom 0.152: v35.5,45.5 v35.5,48.75 | v24.5,9.75 27.25,12.5 v27.25,45.5
MAR2  (via drill 0.35)
  Top 0.152: LED3.A 68,48.25 67,47.25 58,47.25 57,48.25 57,49.75 50,49.75 49.25,50.5 36,50.5 33.5,48 v28.75,48 23.5,48 23,47.5 22.5,47.5 20.5,49.5 20.5,50.75 SEL1.11
  Bottom 0.152: v28.75,48 28.75,3.5 19.5,3.5 18,5 MAR0.5
MAR3  (via drill 0.35)
  Top 0.152: v66,50.5 67.75,50.5 68,50.75 LED4.A | v65.25,40.5 14.25,40.5 v14,40.75
  Bottom 0.152: v66,50.5 65.25,49.75 v65.25,40.5 | 13.75,41 13.75,49.75 SEL1.14 | 13.75,41 13.75,11.75 20.25,5.25 MAR0.6 | 13.75,41 v14,40.75
MAR4  (via drill 0.35)
  Top 0.152: v66,53 67.75,53 68,53.25 LED5.A | v64.5,22.75 62.5,20.75 52.75,20.75 52,20 38.25,20 36.5,18.25 36.5,16 30.5,16 29.75,15.25 15.25,15.25 12.75,17.75 MAR1.3 12.5,18 11,19.5 9,19.5 v4.5,24 | v5.5,57.5 8.5,57.5 10,56 SEL2.2
  Bottom 0.152: v66,53 64.5,51.5 v64.5,22.75 | v5.5,57.5 4.5,56.5 v4.5,24
MAR5  (via drill 0.35)
  Top 0.152: 28,56.25 27,56.25 25.75,57.5 19.5,57.5 18,56 SEL2.5 | 28,56.25 52.25,56.25 53,57 64,57 64.25,56.75 67.25,56.75 68,56 LED6.A | v28,21.75 15.75,21.75 14,23.5 9.75,23.5 9.75,22.5 11.75,20.5 12.5,20.5 15,18 MAR1.4 | 28,56.25 v28,56.75
  Bottom 0.152: v28,56.75 v28,21.75
MAR6  (via drill 0.35)
  Top 0.152: 30.5,61.25 22.75,61.25 20.5,63.5 SEL2.11 | 30.5,61.25 49.25,61.25 50.5,62.5 64,62.5 68,58.5 LED7.A | v29.5,16 19.75,16 18,17.75 MAR1.5 | 30.5,61.25 v30.5,61.5
  Bottom 0.152: v29.5,16 29.25,16.25 29.25,34.5 31.25,36.5 31.25,60.75 v30.5,61.5
MAR7  (via drill 0.35)
  Top 0.152: LED8.A 68.25,61 69.75,62.5 69.75,64.5 61,64.5 60.5,64 51,64 49.25,65.75 15,65.75 12.75,63.5 SEL2.14 | v10.5,22.75 12.25,21 17.25,21 20.25,18 MAR1.6
  Bottom 0.152: v10.5,22.75 9.25,24 9.25,47.75 11.75,50.25 11.75,62.75 12.5,63.5 SEL2.14
MAR8  (via drill 0.35)
  Top 0.152: v39.75,63.5 LED9.A | v37,73 14.5,73 11.75,70.25 | 11.75,70.25 10.25,68.75 SEL3.2 | 11.75,70.25 7.25,70.25 6.5,69.5 6.5,67.75 7.75,66.5 11.25,66.5 11.25,37.5 12.25,36.5 12.5,36.5 12.5,30.5 MAR2.3
  Bottom 0.152: v39.75,63.5 37,66.25 v37,73
MAR9  (via drill 0.35)
  Top 0.152: LED10.A 68,66.25 66.5,67.75 66.5,68.75 29.5,68.75 27.75,70.5 19.75,70.5 18,68.75 SEL3.5 | v22,33.25 21.5,32.75 17.5,32.75 15.25,30.5 MAR2.4
  Bottom 0.152: v22,33.25 21.75,33.5 21.75,60 18.75,63 18.75,67.75 18,68.5 SEL3.5
MAR10  (via drill 0.35)
  Top 0.152: v52.25,71 65.75,71 68,68.75 LED11.A | v45.5,77.75 22,77.75 20.5,76.25 SEL3.11
  Bottom 0.152: v45.5,77.75 v52.25,71 | MAR2.5 18,30.5 18,36.25 18.75,37 18.75,60.5 16.75,62.5 16.75,72.5 20.25,76 SEL3.11
MAR11  (via drill 0.35)
  Top 0.152: v50.5,71.75 67.5,71.75 68,71.25 LED12.A | v49.25,73 49,73.25 38,73.25 36.75,74.5 14.25,74.5 12.75,76 SEL3.14 6.5,70 1.25,70 1.25,31.5 4,28.75 18.75,28.75 20.25,30.25 MAR2.6
  Bottom 0.152: v49.25,73 v50.5,71.75
N$1
  Top 0.152: LED1.C 71.75,43.25 73.75,43.25 R1.1
N$2
  Top 0.152: LED2.C 71.75,45.75 73.75,45.75 R2.1
N$3
  Top 0.152: LED3.C 71.75,48.25 73.75,48.25 R3.1
N$4
  Top 0.152: LED4.C 71.75,51 73.75,51 R4.1
N$5
  Top 0.152: LED5.C 71.75,53.5 73.75,53.5 R5.1
N$6
  Top 0.152: LED6.C 71.75,56 73.75,56 R6.1
N$7
  Top 0.152: LED7.C 71.75,58.5 73.75,58.5 R7.1
N$8
  Top 0.152: LED8.C 71.75,61 73.75,61 R8.1
N$9
  Top 0.152: LED13.C 84.5,43.25 86.5,43.25 R13.1
N$10
  Top 0.152: R9.1 LED9.C
N$11
  Top 0.152: LED10.C 71.75,66.25 73.75,66.25 R10.1
N$12
  Top 0.152: LED11.C 71.75,68.75 73.75,68.75 R11.1
N$13
  Top 0.152: LED12.C 71.75,71.25 73.75,71.25 R12.1
N$14
  Top 0.152: LED14.C 84.5,45.75 86.5,45.75 R14.1
N$15
  Top 0.152: LED15.C 84.5,48.25 86.5,48.25 R15.1
N$16
  Top 0.152: LED16.C 84.5,51 86.5,51 R16.1
N$17
  Top 0.152: LED25.C 84.5,53.5 86.5,53.5 R25.1
N$18
  Top 0.152: LED26.C 84.5,56 86.5,56 R26.1
N$19
  Top 0.152: LED17.C 59,43.25 61.25,43.25 R17.1
N$20
  Top 0.152: LED18.C 59,45.75 61.25,45.75 R18.1
N$21
  Top 0.152: LED19.C 59,48.25 61.25,48.25 R19.1
N$22
  Top 0.152: LED20.C 59,51 61.25,51 R20.1
N$23
  Top 0.152: LED21.C 59,53.5 61.25,53.5 R21.1
N$24
  Top 0.152: LED22.C 59,56 61.25,56 R22.1
N$25
  Top 0.152: LED23.C 59,58.5 61.25,58.5 R23.1
N$26
  Top 0.152: LED24.C 59,61 61.25,61 R24.1
N$27
  Top 0.152: LED27.C 84.5,58.5 86.5,58.5 R27.1
N$28
  Top 0.152: LED28.C 84.5,61 86.5,61 R28.1
N$29
  Top 0.152: R29.1 LED29.C
N$30
  Top 0.152: LED30.C 84.5,66.25 86.5,66.25 R30.1
N$31
  Top 0.152: LED31.C 84.5,68.75 86.5,68.75 R31.1
N$32
  Top 0.152: LED32.C 84.5,71.25 86.5,71.25 R32.1
N$33  (via drill 0.35)
  Top 0.152: v68.75,21 72.75,25 72.75,27 74.5,27 76,25.5 IC1.9
  Bottom 0.152: v68.75,21 68.75,18 IC1.3
N$34  (via drill 0.35)
  Top 0.152: v76,22.75 73.5,25.25 IC1.10
  Bottom 0.152: v76,22.75 76,18 IC1.6
N$35
  Top 0.152: SEL_MAR/SP.C 65.25,33 67.5,33 R36.1
N$37
  Top 0.152: WR_MAR.C 84.5,33 86.5,33 R33.1
N$38
  Top 0.152: SP_DIR.C 65.25,35.75 67.5,35.75 R34.1
N$39
  Top 0.152: WR_SP.C 65.25,38.25 67.5,38.25 R35.1
N$41
  Top 0.152: WR_RAM.C 84.5,35.75 86.5,35.75 R37.1
N$42
  Top 0.152: RD_RAM.C 84.5,38.25 86.5,38.25 R38.1
RST  (via drill 0.35)
  Top 0.152: v83.25,4 81.25,2 7.75,2 3.25,6.5 2,6.5 1.25,7.25 1.25,14.25 8.5,14.25 10,12.75 MAR0.15
  Bottom 0.152: 11.25,24.25 11.25,13.75 10.25,12.75 MAR0.15 | 11.25,24.25 10.25,25.25 MAR1.15 | 11.25,24.25 11.25,37 10.25,38 MAR2.15 | v83.25,4 83.25,26.5 92,35.25 92,44.75 93.5,46.25 U$12.P7
SEL_MAR/SP  (via drill 0.35)
  Top 0.152: v78,32 70.75,32 69.75,33 R36.2 69.5,33 67.75,31.25 v58.75,31.25 | v79,28.25 83.75,23.5 93.5,23.5 U$12.P16 | SEL3.1 7.75,68.5 9.25,67 32.75,67 33,67.25 RAM.2 33.25,67.25 34.25,66.25 53.75,66.25 v55.25,64.75
  Bottom 0.152: v78,32 79,31 v79,28.25 | 6.5,54.75 6.5,44.25 7.5,43.25 SEL1.1 | 6.5,54.75 7.5,55.75 SEL2.1 | 6.5,54.75 6.5,67.5 7.5,68.5 SEL3.1 | v58.75,31.25 55.25,34.75 v55.25,64.75
SP0  (via drill 0.35)
  Top 0.152: 79,41.25 80.75,43 LED13.A | 79,41.25 62.5,41.25 62.25,41 14.75,41 12.75,43 SEL1.3 | SP1.3 72,8.5 v78,8.5 | 79,41.25 v79.75,40.5
  Bottom 0.152: v78,8.5 79.75,10.25 v79.75,40.5
SP1  (via drill 0.35)
  Top 0.152: v78.75,57 82.5,57 82.5,47.25 81,45.75 LED14.A | v21.25,20.75 52.25,20.75 53,21.5 v62.25,21.5
  Bottom 0.152: v78.75,57 78,57.75 78,58.75 80,60.75 80,64 78.75,65.25 66.25,65.25 66.25,54.25 62.5,50.5 62.5,21.5 | 62.5,21.5 62.5,8.75 66,5.25 SP1.2 | SEL1.6 21.25,42.25 v21.25,20.75 | 62.5,21.5 v62.25,21.5
SP2  (via drill 0.35)
  Top 0.152: LED15.A 80.75,48.25 v78.75,46.25 78.75,45.75 80,44.5 83,44.5 83,65.75 81.5,67.25 79.5,67.25 v78.75,68 | v27.5,69.75 29,68.25 65.5,68.25 v65.75,68
  Bottom 0.152: v78.75,46.25 78.75,33.75 77.25,32.25 77.25,6.25 76.25,5.25 SP1.6 | v27.5,69.75 27.5,70.25 25,70.25 24.5,69.75 24.5,52.5 23,51 SEL1.10 | v78.75,68 v65.75,68
SP3  (via drill 0.35)
  Top 0.152: LED16.A 80.75,51 79.5,52.25 v51.25,52.25 50,52.25 49.25,53 17.25,53 15.25,51 SEL1.13 | v55.25,3.5 77,3.5 78.5,5 SP1.7
  Bottom 0.152: v55.25,3.5 49.75,3.5 49.75,22.25 51.75,24.25 51.75,41.75 51.25,42.25 v51.25,52.25
SP4  (via drill 0.35)
  Top 0.152: v78.25,60 78,60 78,55.75 78.5,55.25 79,55.25 80.75,53.5 LED25.A | v67.5,20.25 52.75,20.25 52,19.5 42.25,19.5 40.75,18 SP2.3 | v37,57 35.75,58.25 32,58.25 31.75,58.5 15.25,58.5 12.75,56 SEL2.3
  Bottom 0.152: v78.25,60 79.5,61.25 79.5,62.75 79,63.25 77.75,63.25 77.75,62 67.5,51.75 v67.5,20.25 | v37,57 37.75,56.25 37.75,27 37,26.25 37,11.75 37.75,11 41.75,11 41.75,16.75 40.75,17.75 SP2.3
SP5  (via drill 0.35)
  Top 0.152: v78.75,56 80.75,56 LED26.A | v78,39 77.75,39.25 53.5,39.25 52,37.75 v37,37.75 32,37.75 30.25,36 30.25,35 v19.5,35 | v36.25,15.25 38,15.25 38,17.75 SP2.2
  Bottom 0.152: v78.75,56 78,55.25 v78,39 | v19.5,35 19.25,35.25 19.25,54.75 20.25,55.75 SEL2.6 | v36.25,15.25 36.5,15.5 36.5,33.25 37,33.75 v37,37.75
SP6  (via drill 0.35)
  Top 0.152: v78.75,58 80.5,58 80.75,58.25 LED27.A | v22.75,59.75 23.5,59 31.75,59 32,58.75 v42,58.75
  Bottom 0.152: v78.75,58 82.25,54.5 82.25,4 79.5,1.25 49.25,1.25 49.25,17 48.5,17.75 SP2.6 48.25,18 47.25,19 47.25,26 43,30.25 43,57.75 v42,58.75 | v22.75,59.75 22.75,63.5 SEL2.10
SP7  (via drill 0.35)
  Top 0.152: v78.25,61 80.75,61 LED28.A | v72.25,20.75 71,19.5 69.25,19.5 | 69.25,19.5 60.5,19.5 57,16 52.75,16 51,17.75 SP2.7 | v16,22.75 16.25,22.5 63.25,22.5 64.25,23.5 65.25,23.5 69.25,19.5
  Bottom 0.152: v78.25,61 73,55.75 73,26.75 72.25,26 v72.25,20.75 | v16,22.75 16.25,23 16.25,62.5 SEL2.13
SP8  (via drill 0.35)
  Top 0.152: v78.75,62.5 79.75,62.5 80.75,63.5 LED29.A | v67,9 65.5,7.5 43,7.5 40.75,5.25 SP3.3 | v41.75,71.5 15.5,71.5 12.75,68.75 SEL3.3
  Bottom 0.152: v78.75,62.5 69.5,53.25 69.5,11.5 v67,9 | v41.75,71.5 41.25,71 41.25,57.5 41,57.25 41,27 42.25,25.75 42.25,6.75 40.75,5.25 SP3.3
SP9  (via drill 0.35)
  Top 0.152: v78.5,64.5 79.25,64.5 80.75,66 LED30.A | v64.5,9.75 62.75,8 41,8 38.25,5.25 SP3.2
  Bottom 0.152: v78.5,64.5 67,53 67,20.75 64.5,18.25 v64.5,9.75 | SEL3.6 20.5,68.75 24,72.25 24,76.75 25,77.75 34.75,77.75 34.75,32.5 33.25,31 33.25,10 38,5.25 SP3.2
SP10  (via drill 0.35)
  Top 0.152: v78.75,70 79.5,70 80.75,68.75 LED31.A
  Bottom 0.152: v78.75,70 79,70.25 79,71.25 71.75,78.5 36.25,78.5 | 36.25,78.5 23,78.5 23,76.25 SEL3.10 | 36.25,78.5 36.25,33.5 33.75,31 33.75,12.5 39,7.25 39,3.5 46.75,3.5 48.25,5 SP3.6
SP11  (via drill 0.35)
  Top 0.152: v78.25,71 80.75,71 LED32.A | v62.75,75 61.75,75 58.25,78.5 17.5,78.5 15.25,76.25 SEL3.13
  Bottom 0.152: 62.75,71 57.75,71 57.75,68.25 54,64.5 54,28 52.25,26.25 52.25,6.5 51,5.25 SP3.7 | 62.75,71 v78.25,71 | 62.75,71 v62.75,75
SP_DIR  (via drill 0.35)
  Top 0.152: v73.75,32.75 72.5,32.75 69.75,35.5 R34.2 | v74.75,22 95.25,22 96.25,21 U$12.P22 | SP3.5 45.75,5 48,2.75 78.5,2.75 79.75,4 79.75,6.75 75.25,6.75 73.75,5.25 SP1.5
  Bottom 0.152: SP3.5 45.5,5.25 44.75,6 44.75,17 45.5,17.75 SP2.5 | v73.75,32.75 74.75,31.75 v74.75,22 74.75,6.75 73.75,5.75 73.75,5.25 SP1.5
VCC  (via drill 0.35)
  Top 0.508: SEL2.16 7.5,63.5 5,61 2.75,61 U$5.P+ | SEL3.16 7.5,76 2.75,71.25 U$6.P+ | U$1.P+ 2.75,12.75 7.5,12.75 MAR0.16 7.75,12.5 9.5,10.75 29.75,10.75 30.25,11.25 U$8.P+ 30.5,11.5 34.5,11.5 35.5,12.5 SP3.16 35.75,12.5 37.5,10.75 50,10.75 50.12,10.88 | MAR1.16 7.5,25.25 7.25,25 3.5,25 2.75,24.25 U$2.P+ | 4.5,37 2.75,37 U$3.P+ | 4.5,37 6.5,37 7.5,38 MAR2.16 | 4.5,49.75 2.75,49.75 U$4.P+ | 4.5,49.75 6.5,49.75 7.5,50.75 SEL1.16 | 4.5,49.75 4.5,37 | 93.75,63 93.75,64 U$12.P0 93.5,64.25 93.5,74 46.5,74 45.75,74.75 U$11.P+ | 93.75,63 93.75,61.75 U$12.P1 | 96.5,63 96.5,64 U$12.P39 | 96.5,63 96.5,61.75 U$12.P38 | 96.5,63 93.75,63 | WR_SP.A SP_DIR.A SEL_MAR/SP.A 61.5,33 61.25,32.75 v59.5,32.75 | SP2.11 48.5,25.25 50.25,23.5 57.75,23.5 58.25,24 U$9.P+ 58.5,24.25 59.75,25.5 63.25,25.5 IC1.14 63.5,25.5 66,25.5 IC1.13 66.25,25.5 68.5,25.5 IC1.12 | v68.75,31 78.75,31 80.75,33 WR_MAR.A 81,33.25 81,35.5 WR_RAM.A 81,35.75 81,38 RD_RAM.A 81.25,38 83,39.75 90.5,39.75 v91.25,40.5 | SP2.16 35.5,25.25 34.5,24.25 30.5,24.25 U$7.P+ | 50.12,10.88 50.25,10.75 57.75,10.75 58.25,11.25 U$10.P+ 58.5,11.5 62.5,11.5 63.5,12.5 SP1.16 | 50.12,10.88 48.5,12.5 SP3.11 | v64.5,8.75 64.75,8.75 66.25,10.25 83,10.25 87.5,5.75 C8.+
  Bottom 0.508: U$5.P+ 2.75,61 4,62.25 4,69.75 2.75,71 U$6.P+ | MAR0.16 7.5,12.75 6.5,13.75 6.5,24.25 7.5,25.25 MAR1.16 7.5,25.5 6.5,26.5 6.5,37 7.5,38 MAR2.16 | SEL2.16 7.75,63.5 8.75,62.5 8.75,52 7.75,51 SEL1.16 | RAM.28 48.25,70 45.75,72.5 45.75,74.75 U$11.P+ | v59.5,32.75 59.75,32.5 59.75,25.5 58.5,24.25 U$9.P+ 58.5,24 59.75,22.75 59.75,10 | v68.75,31 68.75,25.5 IC1.12 | SP1.11 75.25,11.75 75.25,6.5 74.75,6 74.75,4 73.25,2.5 59.75,2.5 59.75,10 | 59.75,10 58.5,11.25 U$10.P+ | v64.5,8.75 63.5,8.75 SP1.16 | SP2.16 35.5,25.25 34.25,24 34.25,14 35.5,12.75 SP3.16 | v91.25,40.5 91.25,59.25 93.5,61.5 U$12.P1
WR_RAM2  (via drill 0.35)
  Top 0.152: v61,28.25 75.75,28.25 78.5,25.5 IC1.8 | v60.25,64.75 57.75,67.25 48.5,67.25 RAM.27
  Bottom 0.152: v61,28.25 60.25,29 v60.25,64.75

### Text on the board
tNames: BUS | MAR | STACK | 11 | 11 | 10 | 10 | 9 | 9 | 8 | 8 | 7 | 7 | 7 | 6 | 6 | 6 | 5 | 5 | 5 | 4 | 4 | 4 | 3 | 3 | 3 | 2 | 2 | 2 | 1 | 1 | 1 | 0 | 0 | 0 | WR SP | RD RAM | SP U/!D | WR RAM | MAR/!SP | WR MAR